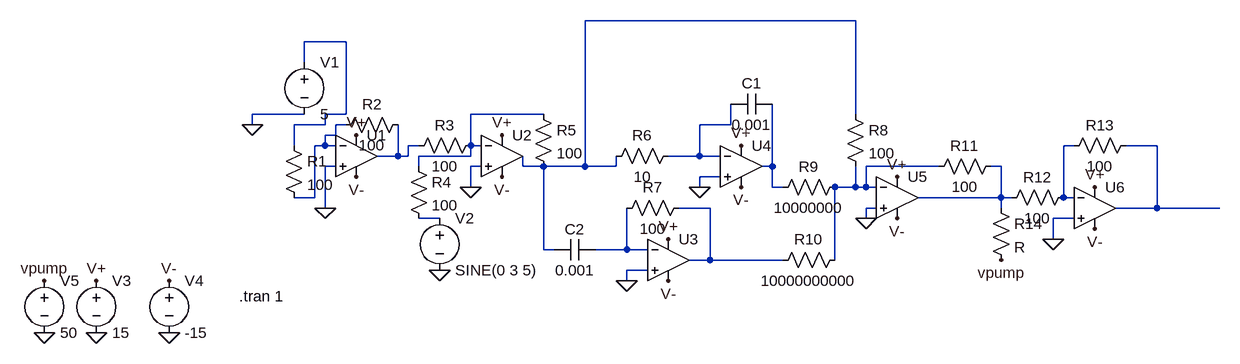
[diagram p0: schematic Self Project.asc]
Self Project.asc, the LTspice schematic file:
Version 4
SHEET 1 1364 680
WIRE 800 -64 384 -64
WIRE 16 -32 -48 -32
WIRE -48 0 -48 -32
WIRE -48 80 -128 80
WIRE 16 80 16 -32
WIRE 16 80 -16 80
WIRE 320 80 208 80
WIRE 800 80 800 -64
WIRE -128 96 -128 80
WIRE -16 96 -16 80
WIRE -16 96 -64 96
WIRE 16 96 0 96
WIRE 608 96 608 64
WIRE 608 96 560 96
WIRE 0 112 0 96
WIRE 0 112 -16 112
WIRE -64 128 -64 96
WIRE -16 128 -16 112
WIRE -16 128 -32 128
WIRE 0 128 -16 128
WIRE 128 128 112 128
WIRE 208 128 208 80
WIRE 224 128 208 128
WIRE 1136 128 1120 128
WIRE 1264 128 1216 128
WIRE 96 144 96 96
WIRE 96 144 64 144
WIRE 112 144 112 128
WIRE 112 144 96 144
WIRE 208 144 208 128
WIRE 208 144 128 144
WIRE 560 144 560 96
WIRE 560 144 512 144
WIRE 592 144 560 144
WIRE 0 160 -16 160
WIRE 128 160 128 144
WIRE 224 160 208 160
WIRE 288 160 288 144
WIRE 320 160 288 160
WIRE 384 160 384 -64
WIRE 384 160 320 160
WIRE 432 160 432 144
WIRE 432 160 384 160
WIRE 672 160 672 64
WIRE 672 160 656 160
WIRE 928 160 816 160
WIRE 1024 160 1008 160
WIRE 592 176 560 176
WIRE 208 192 208 160
WIRE 560 192 560 176
WIRE 672 192 672 160
WIRE 688 192 672 192
WIRE 800 192 800 160
WIRE 800 192 768 192
WIRE 816 192 816 160
WIRE 816 192 800 192
WIRE 832 192 816 192
WIRE -32 208 -32 128
WIRE -32 208 -64 208
WIRE 1024 208 1024 160
WIRE 1024 208 896 208
WIRE 1040 208 1024 208
WIRE 1120 208 1120 128
WIRE 1136 208 1120 208
WIRE -16 224 -16 160
WIRE 576 224 528 224
WIRE 832 224 816 224
WIRE 1024 224 1024 208
WIRE 1264 224 1264 128
WIRE 1264 224 1200 224
WIRE 1360 224 1264 224
WIRE 160 240 128 240
WIRE 816 240 816 224
WIRE 1136 240 1104 240
WIRE 1104 272 1104 240
WIRE 320 288 320 160
WIRE 336 288 320 288
WIRE 448 288 448 224
WIRE 448 288 400 288
WIRE 480 288 448 288
WIRE 576 304 576 224
WIRE 576 304 544 304
WIRE 688 304 576 304
WIRE 768 304 768 192
WIRE 480 320 448 320
WIRE 448 336 448 320
FLAG -16 224 0
FLAG -128 96 0
FLAG 208 192 0
FLAG 560 192 0
FLAG 448 336 0
FLAG 816 240 0
FLAG 1104 272 0
FLAG -368 336 V+
FLAG 32 112 V+
FLAG 256 112 V+
FLAG 512 272 V+
FLAG 624 128 V+
FLAG 864 176 V+
FLAG 1168 192 V+
FLAG -368 416 0
FLAG -256 416 0
FLAG -256 336 V-
FLAG 32 176 V-
FLAG 256 176 V-
FLAG 512 336 V-
FLAG 624 192 V-
FLAG 864 240 V-
FLAG 1168 256 V-
FLAG 160 320 0
FLAG -448 416 0
FLAG -448 336 vpump
FLAG 1024 304 vpump
SYMBOL voltage -48 -16 R0
WINDOW 123 0 0 Left 0
WINDOW 39 0 0 Left 0
SYMATTR InstName V1
SYMATTR Value 5
SYMBOL voltage 160 224 R0
WINDOW 123 0 0 Left 0
WINDOW 39 0 0 Left 0
SYMATTR InstName V2
SYMATTR Value SINE(0 3 5)
SYMBOL res -80 112 R0
SYMATTR InstName R1
SYMATTR Value 100
SYMBOL res 112 80 R90
WINDOW 0 0 56 VBottom 2
WINDOW 3 32 56 VTop 2
SYMATTR InstName R2
SYMATTR Value 100
SYMBOL res 224 112 R90
WINDOW 0 0 56 VBottom 2
WINDOW 3 32 56 VTop 2
SYMATTR InstName R3
SYMATTR Value 100
SYMBOL res 112 144 R0
SYMATTR InstName R4
SYMATTR Value 100
SYMBOL res 304 64 R0
SYMATTR InstName R5
SYMATTR Value 100
SYMBOL res 528 128 R90
WINDOW 0 0 56 VBottom 2
WINDOW 3 32 56 VTop 2
SYMATTR InstName R6
SYMATTR Value 10
SYMBOL cap 672 48 R90
WINDOW 0 0 32 VBottom 2
WINDOW 3 32 32 VTop 2
SYMATTR InstName C1
SYMATTR Value 0.001
SYMBOL res 544 208 R90
WINDOW 0 0 56 VBottom 2
WINDOW 3 32 56 VTop 2
SYMATTR InstName R7
SYMATTR Value 100
SYMBOL cap 400 272 R90
WINDOW 0 0 32 VBottom 2
WINDOW 3 32 32 VTop 2
SYMATTR InstName C2
SYMATTR Value 0.001
SYMBOL res 784 64 R0
SYMATTR InstName R8
SYMATTR Value 100
SYMBOL res 784 176 R90
WINDOW 0 0 56 VBottom 2
WINDOW 3 32 56 VTop 2
SYMATTR InstName R9
SYMATTR Value 10000000
SYMBOL res 784 288 R90
WINDOW 0 0 56 VBottom 2
WINDOW 3 32 56 VTop 2
SYMATTR InstName R10
SYMATTR Value 10000000000
SYMBOL res 1024 144 R90
WINDOW 0 0 56 VBottom 2
WINDOW 3 32 56 VTop 2
SYMATTR InstName R11
SYMATTR Value 100
SYMBOL res 1136 192 R90
WINDOW 0 0 56 VBottom 2
WINDOW 3 32 56 VTop 2
SYMATTR InstName R12
SYMATTR Value 100
SYMBOL OpAmps\\UniversalOpAmp 32 144 R0
SYMATTR InstName U1
SYMBOL OpAmps\\UniversalOpAmp 256 144 R0
SYMATTR InstName U2
SYMBOL OpAmps\\UniversalOpAmp 512 304 R0
SYMATTR InstName U3
SYMBOL OpAmps\\UniversalOpAmp 624 160 R0
SYMATTR InstName U4
SYMBOL OpAmps\\UniversalOpAmp 864 208 R0
SYMATTR InstName U5
SYMBOL OpAmps\\UniversalOpAmp 1168 224 R0
SYMATTR InstName U6
SYMBOL voltage -368 320 R0
WINDOW 123 0 0 Left 0
WINDOW 39 0 0 Left 0
SYMATTR InstName V3
SYMATTR Value 15
SYMBOL voltage -256 320 R0
WINDOW 123 0 0 Left 0
WINDOW 39 0 0 Left 0
SYMATTR InstName V4
SYMATTR Value -15
SYMBOL res 1232 112 R90
WINDOW 0 0 56 VBottom 2
WINDOW 3 32 56 VTop 2
SYMATTR InstName R13
SYMATTR Value 100
SYMBOL res 1008 208 R0
SYMATTR InstName R14
SYMBOL voltage -448 320 R0
WINDOW 123 0 0 Left 0
WINDOW 39 0 0 Left 0
SYMATTR InstName V5
SYMATTR Value 50
TEXT -148 360 Left 2 !.tran 1

The netlist it stands for:
* Self Project.asc
V1 N002 0 5
V2 N013 0 SINE(0 3 5)
R1 N002 N004 100
R2 N006 N004 100
R3 N003 N006 100
R4 N003 N013 100
R5 N003 N001 100
R6 N005 N001 10
C1 N009 N005 0.001
R7 N012 N014 100
C2 N014 N001 0.001
R8 N001 N010 100
R9 N010 N009 10000000
R10 N010 N012 10000000000
R11 N011 N010 100
R12 N007 N011 100
XU1 0 N004 V+ V- N006 level1 Avol=1Meg GBW=10Meg Vos=0 En=0 Enk=0 In=0 Ink=0 Rin=500Meg  ; pins In+ In- V+ V- OUT
XU2 0 N003 V+ V- N001 level1 Avol=1Meg GBW=10Meg Vos=0 En=0 Enk=0 In=0 Ink=0 Rin=500Meg  ; pins In+ In- V+ V- OUT
XU3 0 N014 V+ V- N012 level1 Avol=1Meg GBW=10Meg Vos=0 En=0 Enk=0 In=0 Ink=0 Rin=500Meg  ; pins In+ In- V+ V- OUT
XU4 0 N005 V+ V- N009 level1 Avol=1Meg GBW=10Meg Vos=0 En=0 Enk=0 In=0 Ink=0 Rin=500Meg  ; pins In+ In- V+ V- OUT
XU5 0 N010 V+ V- N011 level1 Avol=1Meg GBW=10Meg Vos=0 En=0 Enk=0 In=0 Ink=0 Rin=500Meg  ; pins In+ In- V+ V- OUT
XU6 0 N007 V+ V- N008 level1 Avol=1Meg GBW=10Meg Vos=0 En=0 Enk=0 In=0 Ink=0 Rin=500Meg  ; pins In+ In- V+ V- OUT
V3 V+ 0 15
V4 V- 0 -15
R13 N008 N007 100
R14 N011 vpump R
V5 vpump 0 50
.tran 1
.lib UniversalOpAmp1.lib
.backanno
.end